# EAGLE schematic multimax_super (EAGLE 6.0)
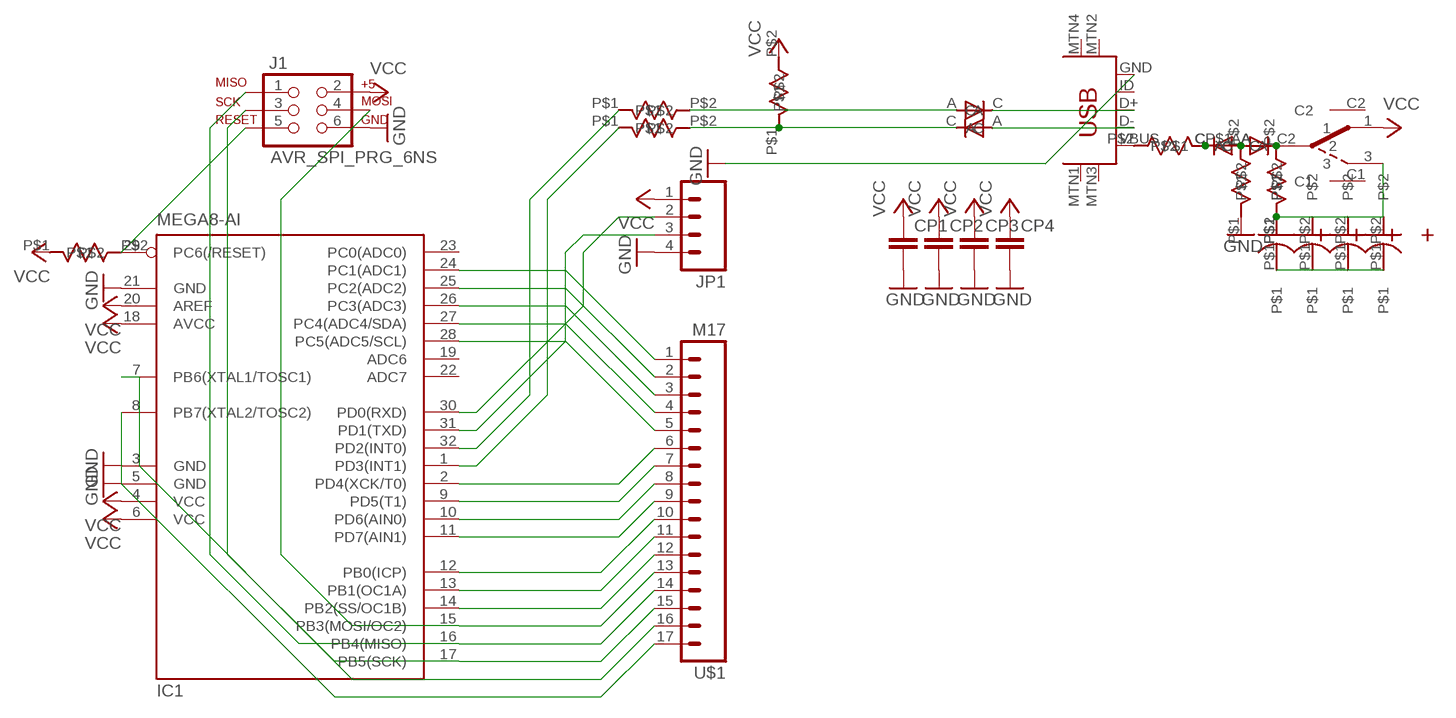
[diagram p0: schematic, sheet 1]

## Parts
CP1  CAPKIT  [CAP-PTH-SMALL-KIT]
CP2  CAPKIT  [CAP-PTH-SMALL-KIT]
CP3  CAPKIT  [CAP-PTH-SMALL-KIT]
CP4  CAPKIT  [CAP-PTH-SMALL-KIT]
IC1  MEGA8-AI  [TQFP32-08]
J1  AVR_SPI_PRG_6NS  [2X3-NS]
JP1  M04PTH  [1X04]
U$1  M17  [1X17]
U$2  R-7  [R-7]
U$3  R-7  [R-7]
U$4  R-7  [R-7]
U$5  D-6  [D-7.5]
U$6  D-6  [D-7.5]
U$7  R-7  [R-7]
U$8  USB-MINIB-5PIN  [USB-MINIB]
U$9  NICHICON_12F  [NICHICON_10X30]
U$10  NICHICON_12F  [NICHICON_10X30]
U$11  NICHICON_12F  [NICHICON_10X30]
U$12  NICHICON_12F  [NICHICON_10X30]
U$13  R-7  [R-7]
U$14  SPST_PTH  [SWITCH2]
U$15  D-6  [D-7.5]
U$16  D-6  [D-7.5]
U$17  R-7  [R-7]
U$18  R-7  [R-7]
U$19  D-6  [D-7.5]
U$20  D-6  [D-7.5]

## Nets
GND: CP1.2 CP2.2 CP3.2 CP4.2 IC1.3(GND) IC1.5(GND) IC1.21(GND) J1.6 JP1.4 U$8.GND U$17.P$1
N$1: IC1.31(PD1(TXD)) JP1.3
N$2: IC1.30(PD0(RXD)) JP1.2
N$3: IC1.29(PC6(/RESET)) J1.5 U$2.P$2
N$4: IC1.17(PB5(SCK)) J1.3 U$1.15
N$5: IC1.16(PB4(MISO)) J1.1 U$1.14
N$6: IC1.15(PB3(MOSI/OC2)) J1.4 U$1.13
N$7: IC1.8(PB7(XTAL2/TOSC2)) U$1.17
N$8: IC1.1(PD3(INT1)) U$4.P$1
N$9: IC1.32(PD2(INT0)) U$3.P$1
N$10: IC1.7(PB6(XTAL1/TOSC1)) U$1.16
N$11: IC1.14(PB2(SS/OC1B)) U$1.12
N$12: IC1.13(PB1(OC1A)) U$1.11
N$13: IC1.12(PB0(ICP)) U$1.10
N$14: IC1.11(PD7(AIN1)) U$1.9
N$15: IC1.10(PD6(AIN0)) U$1.8
N$16: IC1.9(PD5(T1)) U$1.7
N$17: IC1.2(PD4(XCK/T0)) U$1.6
N$18: IC1.28(PC5(ADC5/SCL)) U$1.5
N$19: IC1.27(PC4(ADC4/SDA)) U$1.4
N$20: IC1.26(PC3(ADC3)) U$1.3
N$21: IC1.25(PC2(ADC2)) U$1.2
N$22: IC1.24(PC1(ADC1)) U$1.1
N$23: U$5.C U$8.D+
N$24: U$6.A U$8.D-
N$25: U$3.P$2 U$5.A
N$26: U$4.P$2 U$6.C U$7.P$1
N$27: U$9.P$2 U$10.P$2 U$11.P$2 U$12.P$2 U$14.3 U$18.P$1
N$28: U$15.A U$16.A U$17.P$2 U$19.A U$20.A
N$29: U$14.2 U$16.C U$18.P$2
N$30: U$9.P$1 U$10.P$1 U$11.P$1 U$12.P$1
N$31: U$8.VBUS U$13.P$2
N$32: U$13.P$1 U$15.C U$19.C U$20.C
VCC: CP1.1 CP2.1 CP3.1 CP4.1 IC1.4(VCC) IC1.6(VCC) IC1.18(AVCC) IC1.20(AREF) J1.2 JP1.1 U$2.P$1 U$7.P$2 U$14.1
Unconnected: IC1.19(ADC6) IC1.22(ADC7) IC1.23(PC0(ADC0)) U$8.ID U$8.MTN1(MTN2) U$8.MTN2(MTN3) U$8.MTN3(MTN1) U$8.MTN4 U$14.C1 U$14.C2

## Library data of the parts
CP1-CP4 = SparkFun-Capacitors:CAP: Capacitor Standard 0603 ceramic capacitor, and 0.1" leaded capacitor.
IC1 = atmel:MEGA8: MICROCONTROLLER 8 Kbytes FLASH, 1 kbytes SRAM, 512 bytes EEPROM, USART, 6-channel 10 bit ADC, 2-channel 8 bit ADC Pin compatible with Atmega48, ATMega88, ATMega168 Source: avr.lbr; MPN: ATMEGA8-16AU; OC_FARNELL: 9171371; OC_NEWARK: 73M8863
J1 = SparkFun-Connectors:AVR_SPI_PRG_6: AVR ISP 6 Pin This is the reduced ISP connector for AVR programming. Common on Arduino. This footprint will take up less PCB space and can be used with a 10-pin to 6-pin adapter such as SKU: BOB-08508
JP1 = SparkFun-Connectors:M04: Header 4 Standard 4-pin 0.1" header. Use with straight break away headers (SKU : PRT-00116), right angle break away headers (PRT-00553), swiss pins (PRT-00743), machine pins (PRT-00117), and female headers (PRT-00115). Molex polarized connector foot print use with SKU : PRT-08231 with associated crimp pins and housings. 1MM SMD Version SKU: PRT-10208
U$1 = SparkFun-Connectors:M17: 1x17 .1" header
U$2-U$4 U$7 U$13 U$17 U$18 = Mrule:R-7
U$5 U$6 U$15 U$16 U$19 U$20 = Mrule:D-6
U$8 = SparkFun-Connectors:USB-MINIB: Mini-USB "B" connector with 5th pin broken out. Created new symbol breaking out 5th "ID" pin in mini/micro USB connector spec. See: http://en.wikipedia.org/wiki/Mini_usb#Cables. Uses same footprint as 4-pin symbol. Also added pins to connect to mounting / shield pads if required (probably not generally needed as signals aren't shielded once they leave the connector).
U$9-U$12 = Mrule:NICHICON_12F
U$14 = Mrule:SPST_PTH